# EasyEDA Pro project 万能运放板.epro

# Schematic Schematic1
Assembly Variant: Basic; Board Name: Board1; Create Date: 2026-05-07; Page Name: P1; Project Name: 万能运放板; Schematic Name: Schematic1; Update Date: 2026-05-07; BladeWidth: 10; Company: 嘉立创EDA; Page Size: A4; RegionStart: 1; ShowBorder: 1; TitleBlock: 1; TitleBlockPosition: 3; Version: V1.0; XRegionCount: 6; YRegionCount: 4
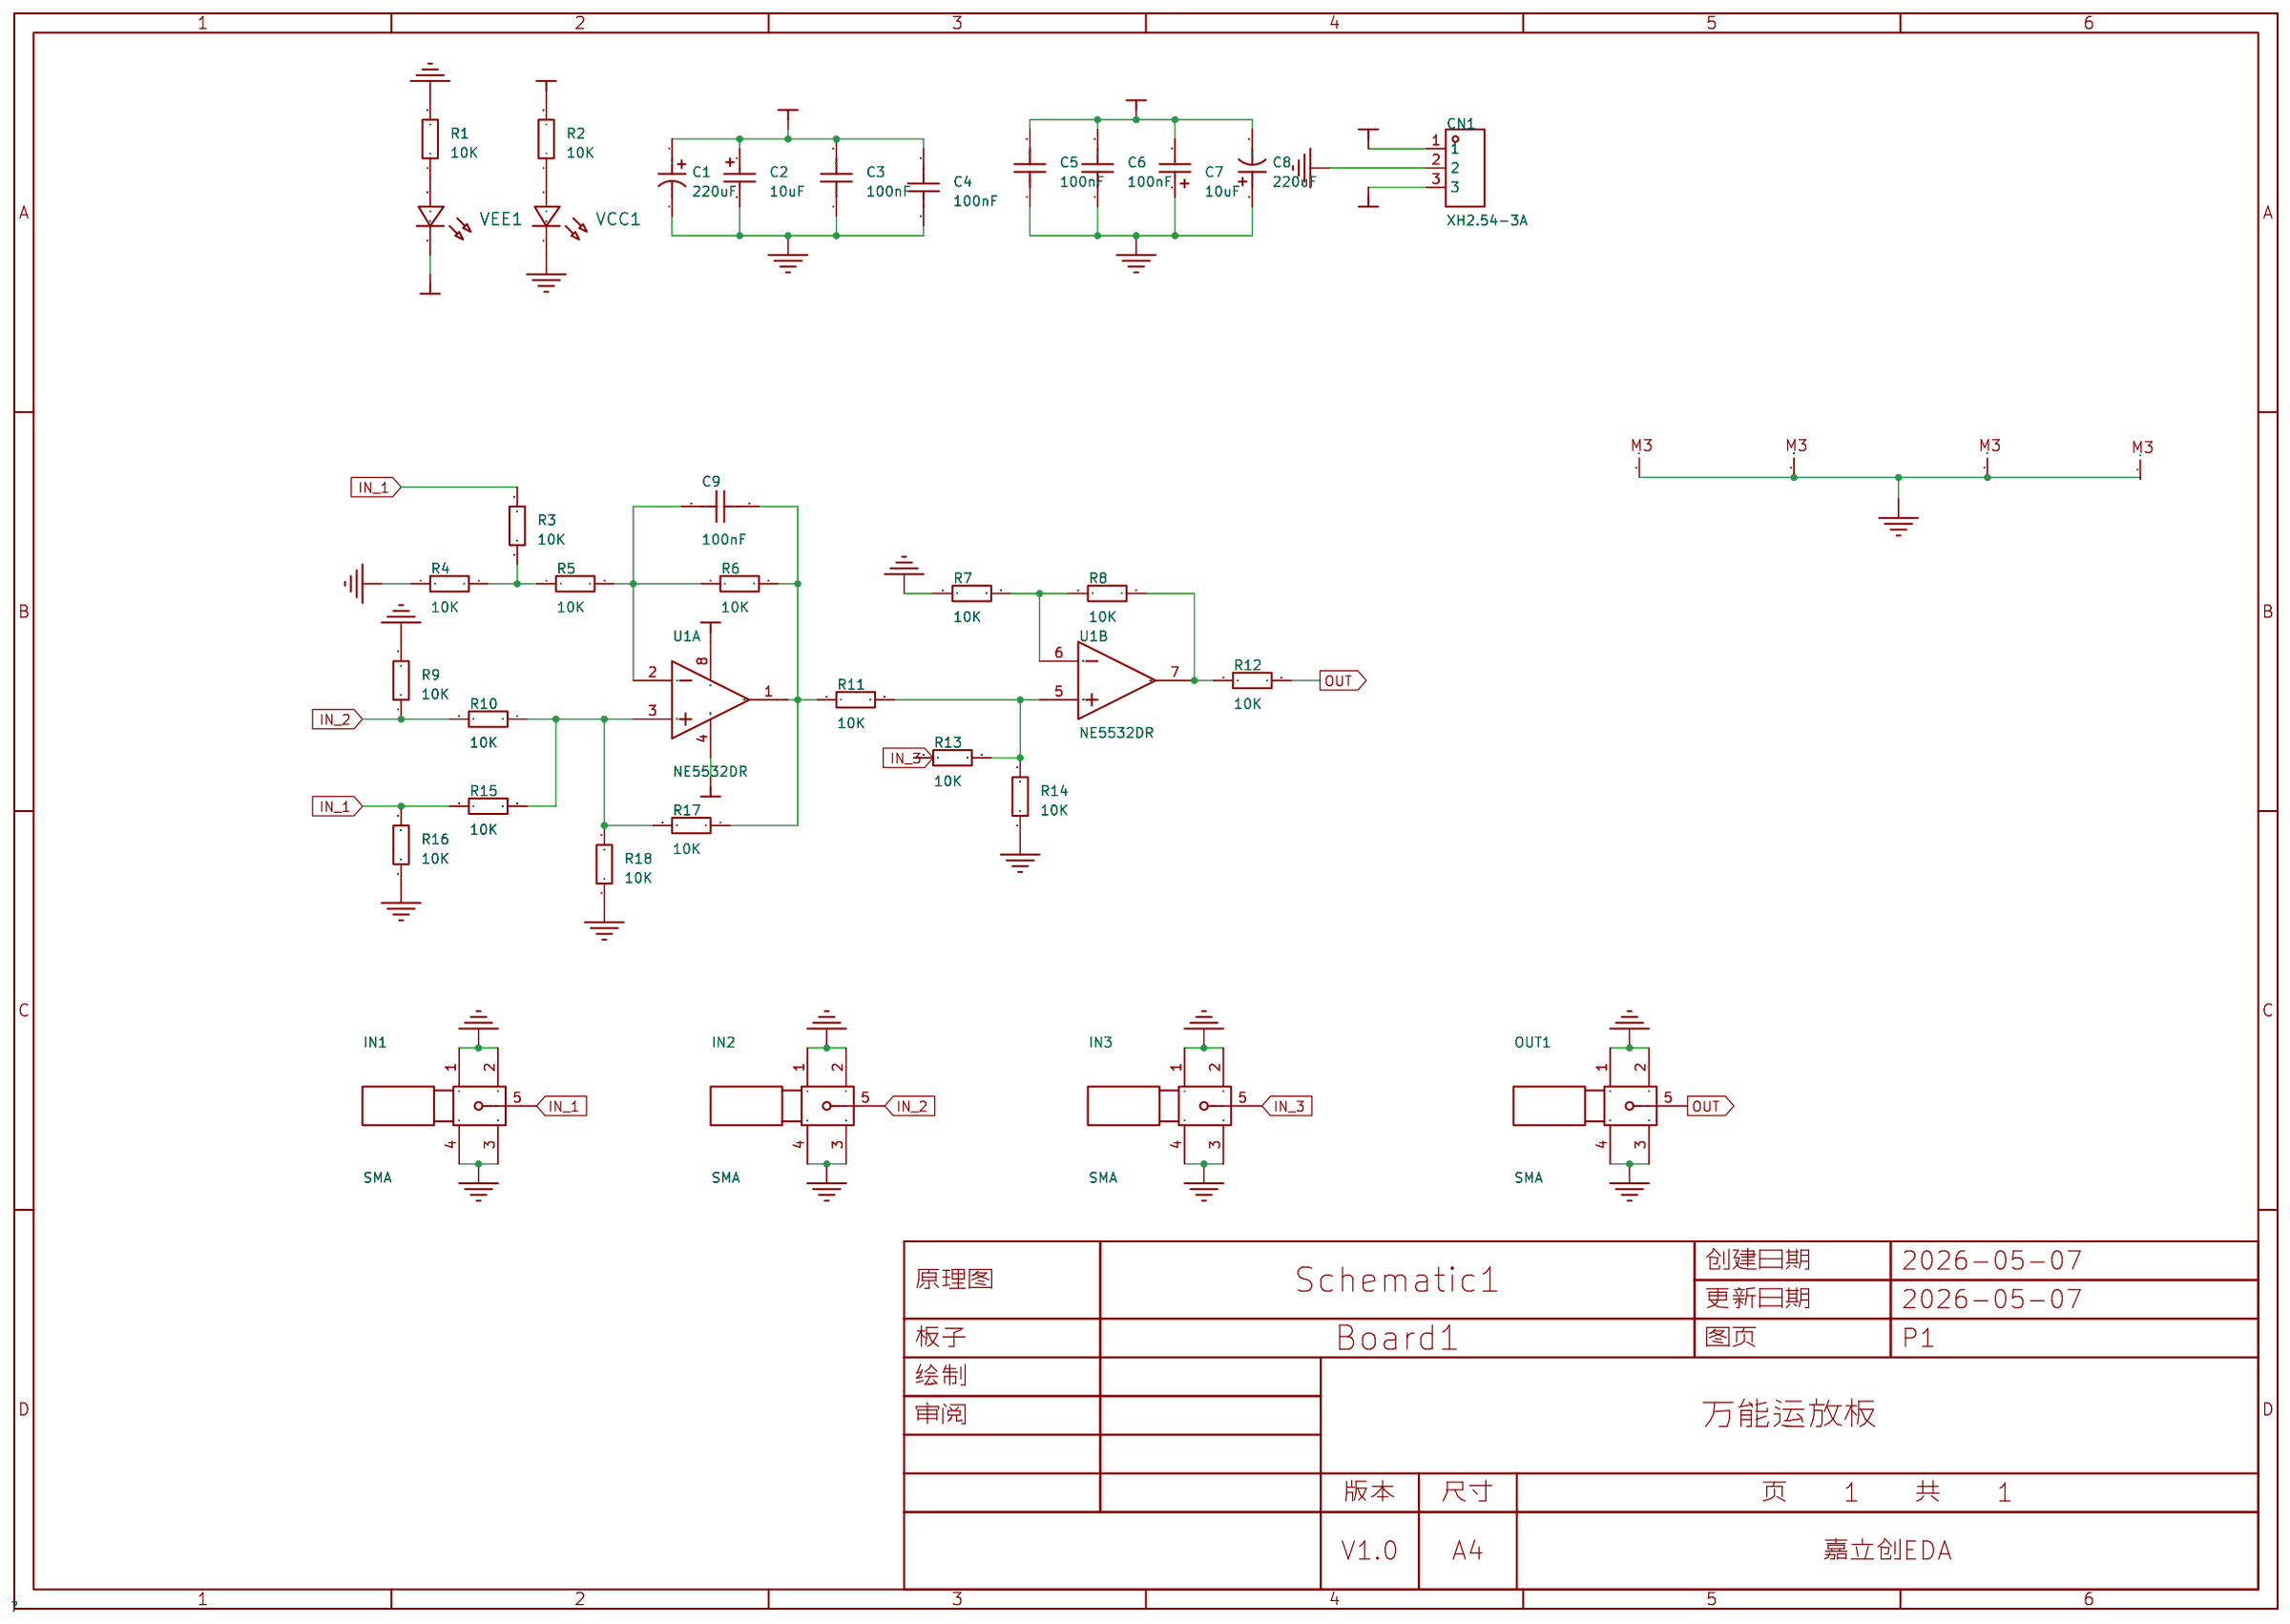
[diagram p0: schematic sheet]

## Parts
C1  220uF  [CAP-SMD_BD6.3-L6.6-W6.6-LS7.3-FD-H7.7]
C2  10uF  [CAP-SMD_L3.2-W1.6-RD-C7171]
C3  100nF  [C0805]
C4  100nF  [C0603]
C5  100nF  [C0603]
C6  100nF  [C0805]
C7  10uF  [CAP-SMD_L3.2-W1.6-RD-C7171]
C8  220uF  [CAP-SMD_BD6.3-L6.6-W6.6-LS7.3-FD-H7.7]
C9  100nF  [C0603]
CN1  XH2.54-3A  [CONN-TH_3P-P2.50_HCTL_XH-3A-L]
IN1  SMA  [SMA-SMD_BWSMA-KE-P001]
IN2  SMA  [SMA-SMD_BWSMA-KE-P001]
IN3  SMA  [SMA-SMD_BWSMA-KE-P001]
M1  -  [M3]
M2  -  [M3]
M3  -  [M3]
M4  -  [M3]
OUT1  SMA  [SMA-SMD_BWSMA-KE-P001]
R1  10K  [R0603]
R2  10K  [R0603]
R3  10K  [R0603]
R4  10K  [R0603]
R5  10K  [R0603]
R6  10K  [R0603]
R7  10K  [R0603]
R8  10K  [R0603]
R9  10K  [R0603]
R10  10K  [R0603]
R11  10K  [R0603]
R12  10K  [R0603]
R13  10K  [R0603]
R14  10K  [R0603]
R15  10K  [R0603]
R16  10K  [R0603]
R17  10K  [R0603]
R18  10K  [R0603]
U1  NE5532DR  [SOIC-8_L4.9-W3.9-P1.27-LS6.0-BL]  (sections 1,2)
VCC1  -  [LED_0603]
VEE1  -  [LED_0603]

## Library data of the parts
C1 C8 = JVJ25V220M6x8: 容值:220uF;精度:±20%;额定电压:25V;纹波电流:120mA@120Hz;; LCSC Part Name: 220uF ±20% 25V; Supplier Part: C46550404; Manufacturer: JIERR(捷而瑞); Supplier Footprint: SMD,D6.3xL7.7mm; JLCPCB Part Class: Extended Part; Datasheet: https://item.szlcsc.com/datasheet/JVJ25V220M6x8/48680098.html; Supplier: LCSC; Tolerance: ±20%; Voltage Rating: 25V; Ripple Current: 120mA@120Hz; Diameter: 6.3mm; Height - Seated (Max): 7.7mm; Lifetime: 2000hrs@105℃; Operating Temperature: -55℃~+105℃
C2 C7 = TAJA106K016RNJ: 容值:10uF;精度:±10%;额定电压:16V;等效串联电阻(ESR):3Ω@100kHz;; LCSC Part Name: 10uF ±10% 16V; Supplier Part: C7171; Manufacturer: Kyocera AVX; Supplier Footprint: CASE-A-3216-18(mm); JLCPCB Part Class: Basic Part; Supplier: LCSC; Tolerance: ±10%; Voltage Rating: 16V; Equivalent Series Resistance(ESR): 3Ω@100kHz; Operating Temperature: -55℃~+125℃
C3 C6 = CAP_0805: Supplier Footprint: 0805
C4 C5 C9 = CAP_0603: Supplier Footprint: 0603
CN1 = XH2.54-3A: Supplier Part: C9900018379; JLCPCB Part Class: Extended Part; Supplier: LCSC
IN1-IN3 OUT1 = SMA: Supplier Part: C9900018296; JLCPCB Part Class: Extended Part; Supplier: LCSC
M1-M4 = 螺丝孔
R1-R18 = Res_0603: Supplier Footprint: 0603
U1 = NE5532DR: 放大器数:2;轨到轨:-;增益带宽积(GBW):10MHz;输入失调电压(Vos):500uV;压摆率(SR):9V/us;输入偏置电流(Ib):1uA;; LCSC Part Name: 低噪声双运算放大器; Supplier Part: C7426; Manufacturer: TI(德州仪器); Supplier Footprint: SOIC-8; JLCPCB Part Class: Basic Part; Datasheet: http://www.ti.com/cn/lit/gpn/ne5532; Supplier: LCSC; Number of Channels: 2; Maximum Power Supply Range (Vdd-Vss): 30V; Gain Bandwidth Product: 10MHz; Vos - Input Offset Voltage: 500uV; Input Offset Voltage Drift(Vos TC): 5uV/℃; Slew Rate: 9V/us; Ib - Input Bias Current: 1uA; Input Offset Current(Ios): 10nA; Input Voltage Noise Density: 5nV/√Hz@1kHz; Common Mode Rejection Ratio(CMRR): 100dB; Quiescent Current: 16mA; Output Current: 38mA; Operating Temperature: 0℃~+70℃; Dual Supply: -15V~15V
VCC1 VEE1 = LED_0603-R: Supplier Footprint: 0603

## Nets
GND: C1.2 C2.2 C3.1 C4.1 C5.1 C6.1 C7.1 C8.1 CN1.2 IN1.1 IN1.2 IN1.3 IN1.4 IN2.1 IN2.2 IN2.3 IN2.4 IN3.1 IN3.2 IN3.3 IN3.4 M1.1 M2.1 M3.1 M4.1 OUT1.1 OUT1.2 OUT1.3 OUT1.4 R1.2 R4.1 R7.1 R9.2 R14.1 R16.1 R18.1 VCC1.1(C)
VCC: C1.1 C2.1 C3.2 C4.2 CN1.1 R2.2 U1.8(VCC+)
VEE: C5.2 C6.2 C7.2 C8.2 CN1.3 U1.4(VCC-/GND) VEE1.1(C)
IN_1: IN1.5 R3.2 R15.1 R16.2
IN_2: IN2.5 R9.1 R10.2
IN_3: IN3.5 R13.1
OUT: OUT1.5 R12.2
$1N1: C9.2 R6.2 R11.1 R17.1 U1.1(OUT1)
$1N2: C9.1 R5.2 R6.1 U1.2(IN1-)
$1N4: R10.1 R15.2 R17.2 R18.2 U1.3(IN1+)
$1N7: R3.1 R4.2 R5.1
$1N13: R11.2 R13.2 R14.2 U1.5(IN2+)
$1N16: R7.2 R8.1 U1.6(IN2-)
$1N21: R8.2 R12.1 U1.7(OUT2)
$1N42: R2.1 VCC1.2(A)
$1N47: R1.1 VEE1.2(A)

# Board PCB1
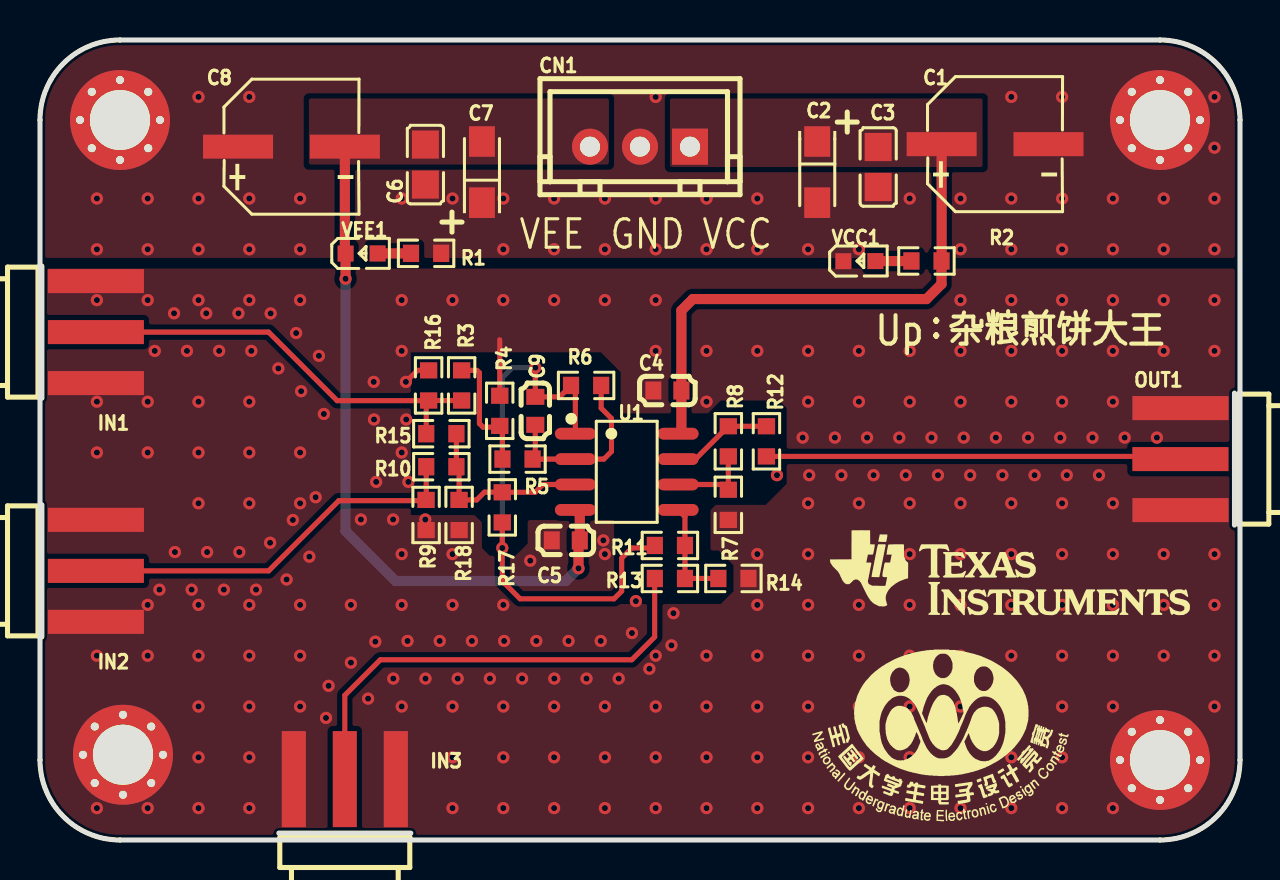
[diagram p1: board, top side]
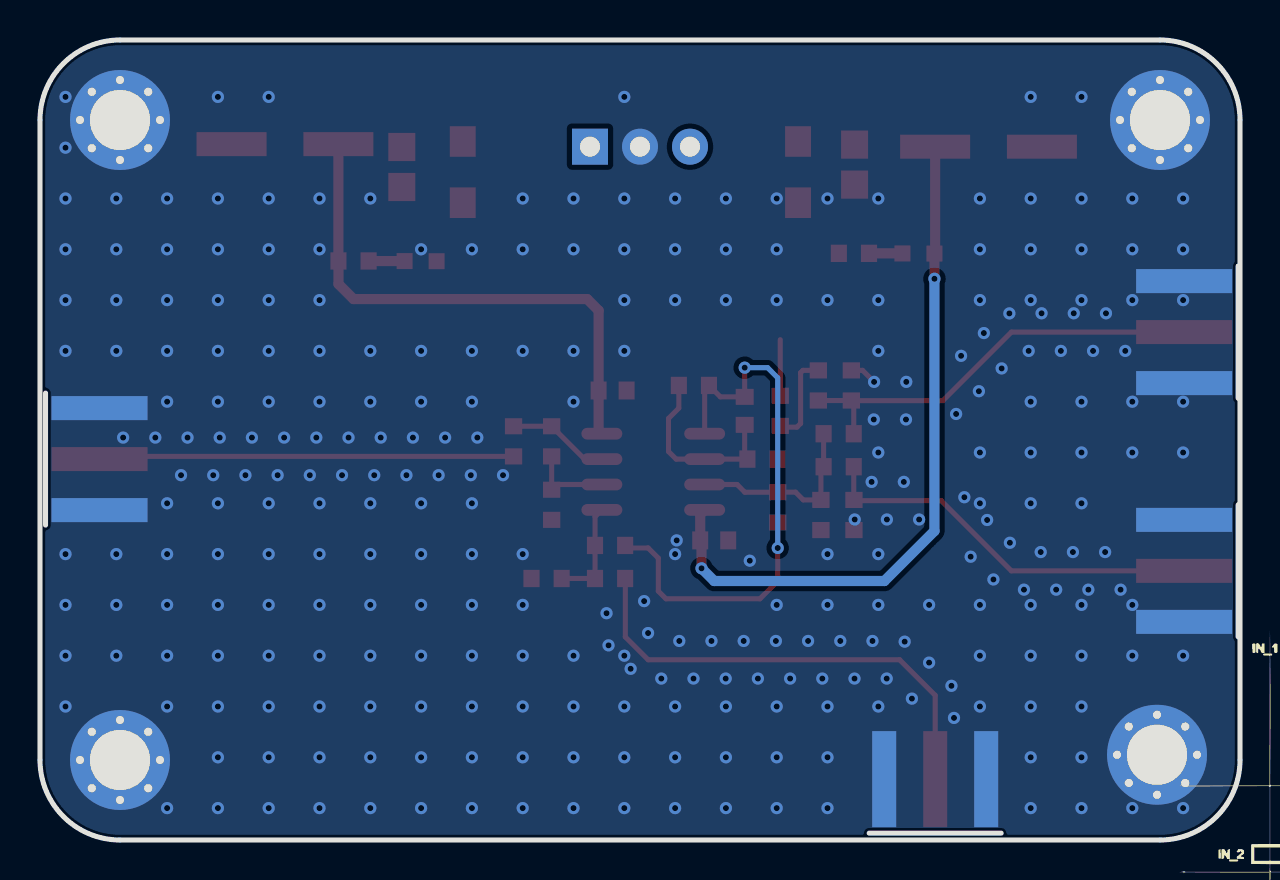
[diagram p2: board, bottom side, seen from below]

Outline 60 x 40 mm; copper layers: Top Layer, Bottom Layer. Coordinates in mm from the lower left corner of the outline.
Outline path: 0,36 0,4 arc(1.17,1.17) 4,0 56,0 arc(58.83,1.17) 60,4 60,36 arc(58.83,38.83) 56,40 4,40 arc(1.17,38.83) 0,36
Stack: Top Layer 0.035mm / Dielectric1 1.51mm FR4 er 4.5 / Bottom Layer 0.035mm

## Design rules (mm)
spacing copperThickness1oz (default): track to track 0.102, other pairs 0.152 to 0.3
spacing copperThickness2oz: track to track 0.203, other pairs 0.152 to 0.3
track width copperThickness1oz (default): min 0.127, default 0.254, max 2.54
track width copperThickness2oz: min 0.203, default 0.254, max 2.54
differential pair differentialPair (default): width min 0.127, default 0.254, max 2.54; gap min 0.152, default 0.152
net VCC uses copperRegion
net GND uses copperRegion
net VEE uses copperRegion

## Placement (name value [footprint] x y rotation side)
C1  220uF  [CAP-SMD_BD6.3-L6.6-W6.6-LS7.3-FD-H7.7]  47.75 34.79 0 top
C2  10uF  [CAP-SMD_L3.2-W1.6-RD-C7171]  38.86 33.4 270 top
C3  100nF  [C0805]  41.91 33.65 90 top
C4  100nF  [C0603]  31.37 22.47 0 top
C5  100nF  [C0603]  26.29 14.98 0 top
C6  100nF  [C0805]  19.27 33.77 90 top
C7  10uF  [CAP-SMD_L3.2-W1.6-RD-C7171]  22.1 33.4 90 top
C8  220uF  [CAP-SMD_BD6.3-L6.6-W6.6-LS7.3-FD-H7.7]  12.57 34.67 0 top
C9  100nF  [C0603]  24.76 21.46 90 top
CN1  XH2.54-3A  [CONN-TH_3P-P2.50_HCTL_XH-3A-L]  30 34.67 0 top
IN1  SMA  [SMA-SMD_BWSMA-KE-P001]  2.79 25.39 180 top
IN2  SMA  [SMA-SMD_BWSMA-KE-P001]  2.79 13.46 180 top
IN3  SMA  [SMA-SMD_BWSMA-KE-P001]  15.24 3.04 270 top
M1  -  [M3]  4 36 0 top
M2  -  [M3]  56 36 0 top
M3  -  [M3]  4.15 4.26 0 top
M4  -  [M3]  56 4 0 top
OUT1  SMA  [SMA-SMD_BWSMA-KE-P001]  57.02 19.05 0 top
R1  10K  [R0603]  19.3 29.33 0 top
R2  10K  [R0603]  44.32 28.95 0 top
R3  10K  [R0603]  21.08 22.73 270 top
R4  10K  [R0603]  22.99 21.46 270 top
R5  10K  [R0603]  23.88 19.05 0 top
R6  10K  [R0603]  27.31 22.73 180 top
R7  10K  [R0603]  34.42 16.76 90 top
R8  10K  [R0603]  34.42 19.93 90 top
R9  10K  [R0603]  19.3 16.25 270 top
R10  10K  [R0603]  20.07 18.66 180 top
R11  10K  [R0603]  31.5 14.73 0 top
R12  10K  [R0603]  36.32 19.93 270 top
R13  10K  [R0603]  31.5 13.08 0 top
R14  10K  [R0603]  34.67 13.08 180 top
R15  10K  [R0603]  20.07 20.31 0 top
R16  10K  [R0603]  19.43 22.73 270 top
R17  10K  [R0603]  23.11 16.63 90 top
R18  10K  [R0603]  20.96 16.25 90 top
U1  NE5532DR  [SOIC-8_L4.9-W3.9-P1.27-LS6.0-BL]  29.34 18.41 270 top
VCC1  -  [LED_0603]  41.02 28.95 0 top
VEE1  -  [LED_0603]  16.13 29.33 0 top

## Footprints (pads in the part's own frame, mm; a bottom-side part is the same pattern mirrored in y, then rotated)
C0603
  rect 0.8x0.9 smd: 1(-0.7,0) 2(0.7,0)
C0805
  rect 1.41x1.35 smd: 1(-1,0) 2(1,0)
CAP-SMD_BD6.3-L6.6-W6.6-LS7.3-FD-H7.7
  rect 3.5x1.2 smd: 1(-2.67,0) 2(2.67,0)
CAP-SMD_L3.2-W1.6-RD-C7171
  rect 1.53x1.296 smd: 1(-1.53,0) 2(1.53,0)
CONN-TH_3P-P2.50_HCTL_XH-3A-L
  rect 1.8x1.8 hole 1: 1(2.5,0)
  round 1.8 hole 1: 2(0,0) 3(-2.5,0)
LED_0603
  rect 0.8x0.8 smd: 1(-0.851,-0.01) 2(0.75,-0.005)
M3
  round 0.6 hole 0.405x0.4: 1(-2,0) 1(-1.41,1.41) 1(-1.41,-1.41) 1(0,2) 1(0,-2) 1(1.41,1.41) 1(1.41,-1.41) 1(2,0)
  round 5 hole 3.005x3: 1(0,0)
R0603
  rect 0.806x0.864 smd: 1(-0.753,0) 2(0.753,0)
SMA-SMD_BWSMA-KE-P001
  rect 4.8x1.2 smd: 1(0,-2.55) 2(0,2.55) 5(0,0)
  rect 4.8x1.2 smd far side: 3(0,2.55) 4(0,-2.55)
SOIC-8_L4.9-W3.9-P1.27-LS6.0-BL
  oval 0.588x2.045 smd: 1(-1.905,-2.57) 2(-0.635,-2.57) 3(0.635,-2.57) 4(1.905,-2.57) 5(1.905,2.57) 6(0.635,2.57) 7(-0.635,2.57) 8(-1.905,2.57)

## Nets
As in the schematic.

## Via types
v1: diameter 0.61, hole 0.305, Top Layer to Bottom Layer, 292 vias

## Routing (per net, layer and track width the routed paths; a pad name or vN(x,y) marks a point on that pad's centre or on a via; arc(x,y) is an arc through that point)
GND: length 4.2
  Top Layer w0.254: R4.1 22.99,25.01 ; v1(18.3,22.91) 18.87,23.48 R16.1
  vias: v1(2.84,32.08) v1(2.84,29.53) v1(2.84,27) v1(2.84,21.92) v1(2.84,19.38) v1(2.84,9.22) v1(2.84,1.59) v1(5.39,32.08) v1(5.39,29.53) v1(5.39,27) v1(5.39,21.92) v1(5.39,19.38) v1(5.39,11.75) v1(5.39,9.22) v1(5.39,1.59) v1(5.74,24.45) v1(5.97,12.52) v1(6.7,26.33) v1(6.74,14.4) v1(7.35,24.45) v1(7.58,12.52) v1(7.92,37.16) v1(7.92,32.08) v1(7.92,29.53) v1(7.92,27) v1(7.92,21.92) v1(7.92,19.38) v1(7.92,16.83) v1(7.92,11.75) v1(7.92,9.22) v1(7.92,6.67) v1(7.92,4.14) v1(7.92,1.59) v1(8.31,26.33) v1(8.35,14.4) v1(8.96,24.45) v1(9.19,12.52) v1(9.92,26.33) v1(9.96,14.4) v1(10.47,37.16) v1(10.47,32.08) v1(10.47,29.53) v1(10.47,27) v1(10.47,21.92) v1(10.47,19.38) v1(10.47,16.83) v1(10.47,11.75) v1(10.47,9.22) v1(10.47,6.67) v1(10.47,4.14) v1(10.47,1.59) v1(10.57,24.45) v1(10.8,12.52) v1(11.53,26.33) v1(11.51,14.86) v1(11.92,23.58) v1(12.33,13.03) v1(12.64,16) v1(12.81,25.35) v1(13,32.08) v1(13,29.53) v1(13,27) v1(13,19.38) v1(13,16.83) v1(13,11.75) v1(13,9.22) v1(13,6.67) v1(13.06,22.44) v1(13.47,14.17) v1(13.78,17.14) v1(13.95,24.21) v1(14.19,21.3) v1(14.3,6.1) v1(14.43,7.71) v1(15.54,11.75) v1(15.55,8.87) v1(16.04,16.03) v1(16.41,7.07) v1(16.69,22.91) v1(16.7,21.03) v1(16.81,17.91) v1(16.77,9.92) v1(17.66,16.03) v1(17.66,8.07) v1(18.09,32.08) v1(18.09,27) v1(18.09,24.45) v1(18.09,19.38) v1(18.09,14.3) v1(18.09,11.75) v1(18.09,6.67) v1(18.31,21.03) v1(18.42,17.91) v1(18.38,9.95) v1(19.26,16.03) v1(19.28,8.07) v1(19.99,9.95) v1(20.62,32.08) v1(20.62,27) v1(20.62,14.3) v1(20.62,11.75) v1(20.62,6.67) v1(20.62,4.14) v1(20.62,1.59) v1(20.88,8.07) v1(21.6,9.95) v1(22.5,8.07) v1(23.16,32.08) v1(23.16,29.53) v1(23.16,27) v1(23.16,11.75) v1(23.21,9.95) v1(23.16,6.67) v1(23.16,4.14) v1(23.16,1.59) v1(24.1,8.07) v1(24.51,13.97) v1(24.82,9.95) v1(25.71,32.08) v1(25.71,29.53) v1(25.71,27) v1(25.72,8.07) v1(25.71,6.67) v1(25.71,4.14) v1(25.71,1.59) v1(26.43,9.95) v1(27.32,8.07) v1(28.04,9.95) v1(28.25,32.08) v1(28.25,29.53) v1(28.25,27) v1(28.17,14.98) v1(28.25,14.3) v1(28.25,6.67) v1(28.25,4.14) v1(28.25,1.59) v1(28.94,8.07) v1(29.6,10.35) v1(29.79,11.94) v1(30.47,8.56) v1(30.78,37.16) v1(30.78,32.08) v1(30.78,29.53) v1(30.78,27) v1(30.78,24.45) v1(30.78,9.22) v1(30.78,6.67) v1(30.78,4.14) v1(30.78,1.59) v1(31.57,9.73) v1(31.67,11.34) v1(33.32,32.08) v1(33.32,29.53) v1(33.32,24.45) v1(33.32,21.92) v1(33.32,9.22) v1(33.32,6.67) v1(33.32,4.14) v1(33.32,1.59) v1(35.87,32.08) v1(35.87,29.53) v1(35.87,24.45) v1(35.87,14.3) v1(35.87,11.75) v1(35.87,9.22) v1(35.87,6.67) v1(35.87,4.14) v1(35.87,1.59) v1(36.85,18.24) v1(38.13,20.12) v1(38.41,29.53) v1(38.41,24.45) v1(38.41,21.92) v1(38.41,16.83) v1(38.41,14.3) v1(38.41,11.75) v1(38.41,9.22) v1(38.41,6.67) v1(38.41,4.14) v1(38.41,1.59) v1(38.46,18.24) v1(39.74,20.12) v1(40.07,18.24) v1(40.94,29.53) v1(40.94,24.45) v1(40.94,21.92) v1(40.94,16.83) v1(40.94,14.3) v1(40.94,11.75) v1(40.94,9.22) v1(40.94,6.67) v1(40.94,4.14) v1(40.94,1.59) v1(41.35,20.12) v1(41.68,18.24) v1(42.96,20.12) v1(43.29,18.24) v1(43.49,32.08) v1(43.49,24.45) v1(43.49,21.92) v1(43.49,16.83) v1(43.49,14.3) v1(43.49,11.75) v1(43.49,9.22) v1(43.49,6.67) v1(43.49,4.14) v1(43.49,1.59) v1(44.57,20.12) v1(44.9,18.24) v1(46.03,32.08) v1(46.03,29.53) v1(46.03,27) v1(46.03,24.45) v1(46.03,21.92) v1(46.03,16.83) v1(46.03,14.3) v1(46.03,11.75) v1(46.03,9.22) v1(46.03,6.67) v1(46.03,4.14) v1(46.03,1.59) v1(46.18,20.12) v1(46.51,18.24) v1(47.79,20.12) v1(48.12,18.24) v1(48.56,37.16) v1(48.56,32.08) v1(48.56,29.53) v1(48.56,27) v1(48.56,24.45) v1(48.56,21.92) v1(48.56,16.83) v1(48.56,14.3) v1(48.56,11.75) v1(48.56,9.22) v1(48.56,6.67) v1(48.56,4.14) v1(48.56,1.59) v1(49.4,20.12) v1(49.73,18.24) v1(51.01,20.12) v1(51.1,37.16) v1(51.1,32.08) v1(51.1,29.53) v1(51.1,27) v1(51.1,24.45) v1(51.1,21.92) v1(51.1,16.83) v1(51.1,14.3) v1(51.1,11.75) v1(51.1,9.22) v1(51.1,6.67) v1(51.1,4.14) v1(51.1,1.59) v1(51.34,18.24) v1(52.62,20.12) v1(52.95,18.24) v1(53.65,32.08) v1(53.65,29.53) v1(53.65,27) v1(53.65,24.45) v1(53.65,21.92) v1(53.65,16.83) v1(53.65,14.3) v1(53.65,11.75) v1(53.65,9.22) v1(53.65,6.67) v1(53.65,1.59) v1(54.23,20.12) v1(55.84,20.12) v1(56.19,32.08) v1(56.19,29.53) v1(56.19,27) v1(56.19,24.45) v1(56.19,14.3) v1(56.19,11.75) v1(56.19,9.22) v1(58.72,37.16) v1(58.72,34.61) v1(58.72,32.08) v1(58.72,29.53) v1(58.72,27) v1(58.72,24.45) v1(58.72,14.3) v1(58.72,11.75) v1(58.72,9.22) v1(58.72,6.67)
VCC: length 26.8
  Top Layer w0.508: C1.1 45.08,28.96 R2.2 45.08,27.8 44.32,27.05 32.64,27.05 32.07,26.48 C4.2 32.07,20.48 31.91,20.31
VEE: length 35.2
  Top Layer w0.508: U1.4 26.99,16.28 C5.2 26.92,14.92 v1(26.92,13.58) ; C8.2 15.24,29.36 VEE1.1 v1(15.28,28.06)
  Bottom Layer w0.508: v1(15.28,28.06) 15.28,15.45 17.78,12.95 26.29,12.95 v1(26.92,13.58)
IN_1: length 21.5
  Top Layer w0.254: R3.2 R16.2 19.42,21.97 ; 19.42,21.97 19.31,21.86 R15.1 ; 19.42,21.97 14.86,21.97 11.43,25.39 2.67,25.39
IN_2: length 19.6
  Top Layer w0.254: IN2.5 11.43,13.46 14.94,16.97 19.26,16.97 R9.1 19.31,17.01 R10.2
IN_3: length 23.8
  Top Layer w0.254: IN3.5 15.24,7.23 17.02,9.01 29.59,9.01 30.73,10.16 30.73,13.07 R13.1
OUT: length 20.8
  Top Layer w0.254: R12.2 56.89,19.18 OUT1.5
$1N1: length 29.4
  Top Layer w0.254: v1(24.76,23.62) C9.2 25.98,22.16 R6.2 26.77,22.51 U1.1 ; R17.1 v1(23.11,14.6) 23.11,12.95 24,12.06 28.7,12.06 29.08,12.44 29.08,14.09 29.59,14.6 30.62,14.6 R11.1
  Bottom Layer w0.254: v1(24.76,23.62) 23.62,23.62 23.11,23.11 v1(23.11,14.6)
$1N2: length 9.4
  Top Layer w0.254: C9.1 24.76,19.18 R5.2 U1.2 28.19,19.05 28.57,19.43 28.57,21.08 28.06,21.59 R6.1
$1N4: length 9.5
  Top Layer w0.254: R15.2 R10.1 20.96,18.53 R18.2 21.84,17 22.22,17.39 23.11,17.39 R17.2 24.76,17.39 25.15,17.78 26.77,17.78
$1N7: length 6.3
  Top Layer w0.254: R5.1 23.12,20.57 R4.2 22.93,20.64 22.15,20.64 21.97,20.82 21.97,23.36 21.85,23.48 R3.1
$1N13: length 5.2
  Top Layer w0.254: 31.91,16.5 32.25,16.16 R11.2 R13.2 R14.2
$1N16: length 4.3
  Top Layer w0.254: R8.1 R7.2 34.15,17.78 31.91,17.78
$1N21: length 5.1
  Top Layer w0.254: R12.1 R8.2 32.77,19.05 31.91,19.05
$1N42: length 1.8
  Top Layer w0.508: R2.1 43.56,28.95 VCC1.2
$1N47: length 1.7
  Top Layer w0.508: VEE1.2 16.88,29.33 R1.1

## Copper pours and planes (outline as drawn; the poured copper is in the pictures)
GND on Top Layer: 0.09,28.57 60.07,28.57 60.07,-0.13 0.09,-0.13
GND on Top Layer: 0,40 60,40 60,29.1 0,29.1
GND on Bottom Layer: -0.25,40.13 60.58,40.13 60.58,-0.13 -0.25,-0.13
VCC on Top Layer: 31.5,37.08 47.13,37.08 47.13,33.65 31.5,33.65
VEE on Top Layer: 13.44,37.08 28.45,37.08 28.45,33.77 13.44,33.77

## Text on the board
Top Silkscreen Layer: VEE | GND | VCC | Up：杂粮煎饼大王
